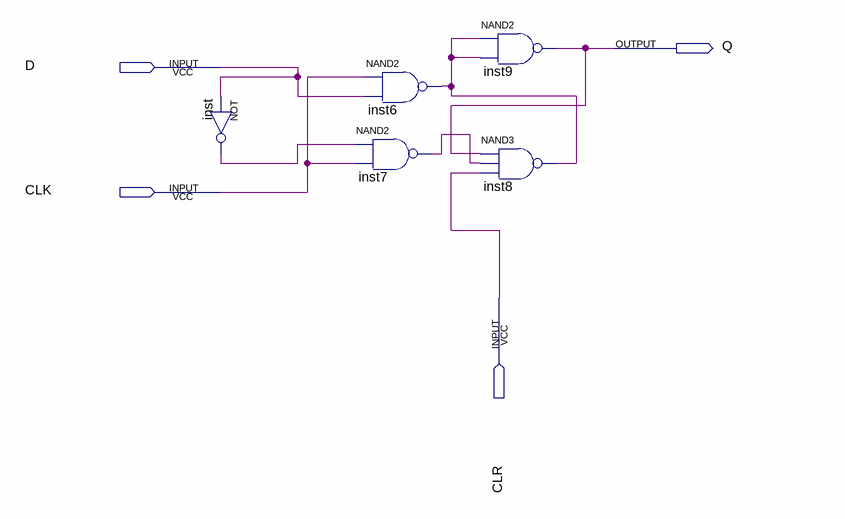
[diagram p0: schematic sheet]
// Quartus schematic FlipFlop_D_CLR.bdf as structural Verilog: 5 symbols, 4 pins
module FlipFlop_D_CLR (
  input  D,
  input  CLK,
  input  CLR,
  output Q
);

  wire inst6_out, inst7_out, inst_out;

  not inst (inst_out, D);
  nand inst6 (inst6_out, CLK, D);
  nand inst7 (inst7_out, inst_out, CLK);
  nand inst9 (Q, inst6_out, inst6_out);
  nand inst8 (inst6_out, Q, inst7_out, CLR);
endmodule
